# Altium schematic sheet TSTBTN_Sheet.SchDoc: Test Button Sheet
size A4; Author: Fabian INGREMEAU; Revision: 1.0.0; SheetNumber: 2; SheetTotal: 3; ProjectName: TheTomcatProject
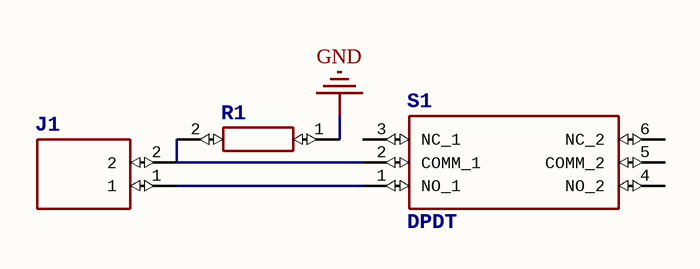
[diagram p0: TSTBTN_Sheet.SchDoc]

## Parts
J1  (no value)  [2518086]
R1  (no value)  [RESC2012X65N]
S1  DPDT  [7346763]

## Nets
GND: R1.1
NetJ1_1: J1.1 S1.1(NO_1)
NetJ1_2: J1.2 R1.2 S1.2(COMM_1)

Not connected (* = marked no-connect by the designer): S1 3(NC_1) 4(NO_2) 5(COMM_2) 6(NC_2)

## Notes on the sheet
- Title
- Size:
- Date:
- A4
- Number:
- Time:
- Revision:
- Sheet
- of
- File:

## Library data of the parts
J1 = 251-8086: Manufacturer_Name: RS Components; Manufacturer_Part_Number: 251-8086; Height: 9.4mm
R1 = CRG0805F10K: Manufacturer_Name: TE Connectivity; Manufacturer_Part_Number: CRG0805F10K; Mouser_Part_Number: N/A; Mouser_Price-Stock: https://www.mouser.co.uk/ProductDetail/TE-Connectivity/CRG0805F10K?qs=9ylKvqdyudm5ckRCC7pxbQ%3D%3D; Arrow_Part_Number: CRG0805F10K; Arrow_Price-Stock: https://www.arrow.com/en/products/crg0805f10k/te-connectivity?region=nac; Height: 0.65mm
S1 = 734-6763: Manufacturer_Name: RS Components; Manufacturer_Part_Number: 734-6763; Height: 11.23mm